# EAGLE design EasyCAN_diy (EAGLE 6.5.0)
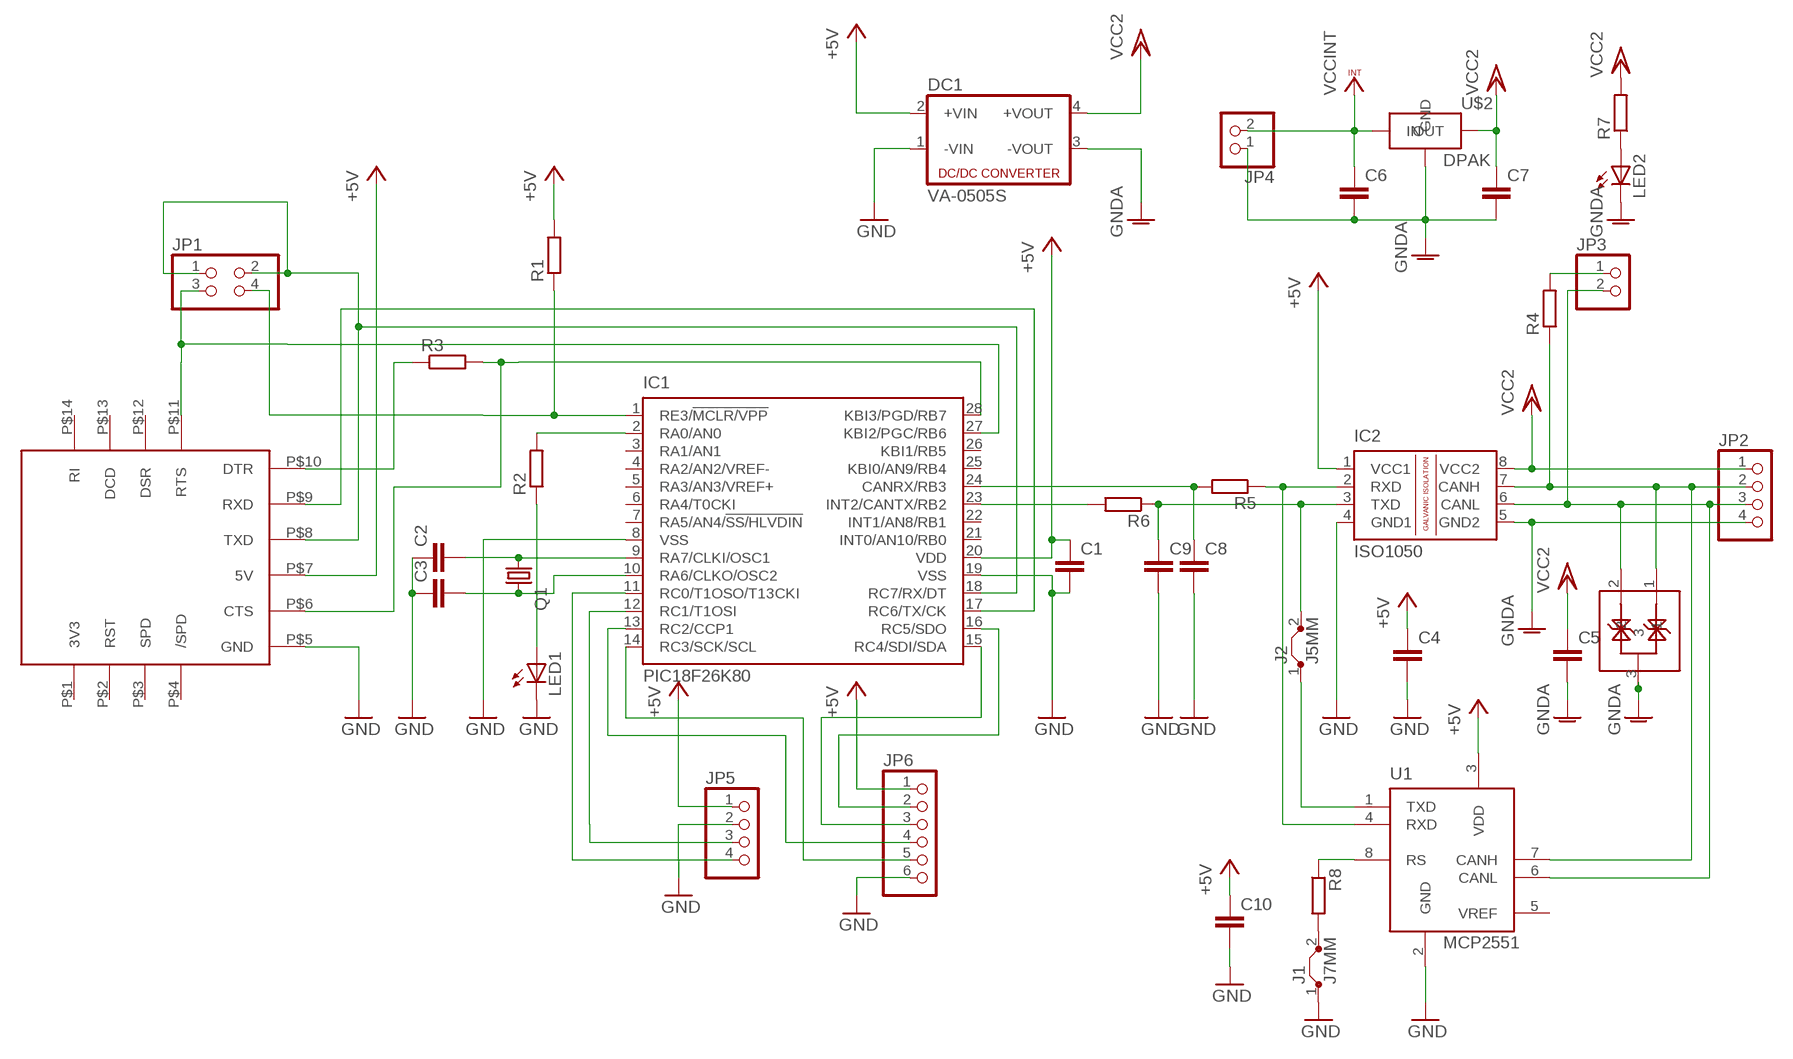
[diagram p0: schematic, sheet 1]

## Parts
C1  C-EUC1206  [C1206]
C2  C-EUC1206  [C1206]
C3  C-EUC1206  [C1206]
C4  C-EUC1206  [C1206]
C5  C-EUC1206  [C1206]
C6  C-EUC1206  [C1206]
C7  C-EUC1206  [C1206]
C8  C-EUC1206  [C1206]
C9  C-EUC1206  [C1206]
C10  C-EUC1206  [C1206]
D1  NUP2105L  [TO236]
DC1  VA-0505S  [4SIL]
IC1  PIC18F26K80  PIC18F26K80-E/SO  [SO28W]
IC2  ISO1050  ISO1050DUB  [DUB-R-PDSO-G8]
J1  J7MM  [07]
J2  J5MM  [05]
JP1  PINHD-2X2  [2X02]
JP2  PINHD-1X4  [1X04]
JP3  PINHD-1X2  [1X02]
JP4  PINHD-1X2  [1X02]
JP5  PINHD-1X4  [1X04]
JP6  PINHD-1X6  [1X06]
LED1  LEDSML1206  [SML1206]
LED2  LEDSML1206  [SML1206]
Q1  CRYSTALHC49UP  [HC49UP]
R1  R-EU_R1206  [R1206]
R2  R-EU_R1206  [R1206]
R3  R-EU_R1206  [R1206]
R4  R-EU_0204/7  [0204/7]
R5  R-EU_R1206  [R1206]
R6  R-EU_R1206  [R1206]
R7  R-EU_R1206  [R1206]
R8  R-EU_R1206  [R1206]
U1  MCP2551  MCP2551SO  [SO-08]
U$1  BTE13-007  [BTE13-007]
U$2  7805-DPAK  [7805-DPAK]

## Nets
+5V: C1.1 C4.1 C10.1 DC1.2(+VIN) IC1.20(VDD) IC2.1(VCC1) JP5.1 JP6.1 R1.2 U1.3(VDD) U$1.P$7(5V)
GND: C1.2 C2.1 C3.1 C4.2 C8.2 C9.2 C10.2 DC1.1(-VIN) IC1.8(VSS) IC1.19(VSS) IC2.4(GND1) J1.1 JP5.2 JP6.6 LED1.C U1.2(GND) U$1.P$5(GND)
GNDA: C5.2 C6.2 C7.2 D1.3 DC1.3(-VOUT) IC2.5(GND2) JP2.4 JP4.1 LED2.C U$2.GND
N$1: IC1.18(RC7/RX/DT) JP1.1 JP1.2 U$1.P$8(TXD)
N$2: IC1.17(RC6/TX/CK) U$1.P$9(RXD)
N$3: C2.2 IC1.9(RA7/CLKI/OSC1) Q1.2
N$4: C3.2 IC1.10(RA6/CLKO/OSC2) Q1.1
N$5: IC1.2(RA0/AN0) R2.2
N$6: IC1.1(RE3/!MCLR/VPP) JP1.4 R1.1
N$7: IC1.27(KBI2/PGC/RB6) JP1.3 U$1.P$11(RTS)
N$8: IC2.2(RXD) R5.1 U1.4(RXD)
N$9: IC1.28(KBI3/PGD/RB7) R3.2 U$1.P$6(CTS)
N$10: R3.1 U$1.P$10(DTR)
N$11: C8.1 IC1.24(CANRX/RB3) R5.2
N$12: J1.2 R8.2
N$13: LED2.A R7.1
N$14: R8.1 U1.8(RS)
N$15: C9.1 IC2.3(TXD) J2.2 R6.1
N$16: JP3.1 R4.2
N$17: LED1.A R2.1
N$18: IC1.11(RC0/T1OSO/T13CKI) JP5.4
N$19: IC1.12(RC1/T1OSI) JP5.3
N$20: IC1.13(RC2/CCP1) JP6.4
N$21: IC1.14(RC3/SCK/SCL) JP6.5
N$22: IC1.15(RC4/SDI/SDA) JP6.3
N$23: IC1.16(RC5/SDO) JP6.2
N$24: D1.2 IC2.6(CANL) JP2.3 JP3.2 U1.6(CANL)
N$25: D1.1 IC2.7(CANH) JP2.2 R4.1 U1.7(CANH)
N$26: IC1.23(INT2/CANTX/RB2) R6.2
N$27: J2.1 U1.1(TXD)
VCC/2: C5.1 C7.1 DC1.4(+VOUT) IC2.8(VCC2) JP2.1 R7.2 U$2.OUT ; supply symbol labelled VCC2
VCCINT: C6.1 JP4.2 U$2.IN
Unconnected: IC1.3(RA1/AN1) IC1.4(RA2/AN2/VREF-) IC1.5(RA3/AN3/VREF+) IC1.6(RA4/T0CKI) IC1.7(RA5/AN4/!SS/HLVDIN) IC1.21(INT0/AN10/RB0) IC1.22(INT1/AN8/RB1) IC1.25(KBI0/AN9/RB4) IC1.26(KBI1/RB5) U1.5(VREF) U$1.P$2(RST) U$1.P$3(SPD) U$1.P$4(/SPD) U$1.P$12(DSR) U$1.P$13(DCD) U$1.P$14(RI)

## Power pins joined to a net without a drawn wire
3V3: U$1.P$1(3V3)

## Library data of the parts
C1-C10 = resistor:C-EU: CAPACITOR, European symbol
D1 = CANBUS Protector:NUP2105L: DUAL BIDIRECTIONAL VOLTAGE SUPPRESSOR 350 W PEAK POWER
DC1 = dc-dc-converter:VA-*?: DC DC Converter Single Output, 1 Watt Motien Technology Co.,Ltd. Source: va-serie.pdf
IC1 = PIC18F26K80:PIC18F26K80: 28-Pin Enhanced Flash Microcontrollers with ECAN(TM) Technology 10-Bit A/D and nanoWatt Technology Source: http://www.microchip.com .. 39637a.pdf
IC2 = texas:ISO1050: ISOLATED CAN TRANSCEIVER Source: http://focus.ti.com/lit/ds/symlink/iso1050.pdf; MPN: ISO1050DUBR; OC_FARNELL: 1755712; OC_NEWARK: 14R9899
J1 J2 = jumper:J: Bridge
JP1 = pinhead:PINHD-2X2: PIN HEADER
JP2 JP5 = pinhead:PINHD-1X4: PIN HEADER
JP3 JP4 = pinhead:PINHD-1X2: PIN HEADER
JP6 = pinhead:PINHD-1X6: PIN HEADER
LED1 LED2 = led:LED: LED OSRAM: - CHIPLED LG R971, LG N971, LY N971, LG Q971, LY Q971, LO R971, LY R971 LH N974, LH R974 LS Q976, LO Q976, LY Q976 LO Q996 - Hyper CHIPLED LW Q18S LB Q993, LB Q99A, LB R99A - SideLED LS A670, LO A670, LY A670, LG A670, LP A670 LB A673, LV A673, LT A673, LW A673 LH A674 LY A675 LS A676, LA A676, LO A676, LY A676, LW A676 LS A679, LY A679, LG A679 - Hyper Micro SIDELED® LS Y876, LA Y876, LO Y876, LY Y876 LT Y87S - SmartLED LW L88C, LW L88S LB L89C, LB L89S, LG L890 LS L89K, LO L89K, LY L89K LS L896, LA L896, LO L896, LY L896 - TOPLED LS T670, LO T670, LY T670, LG T670, LP T670 LSG T670, LSP T670, LSY T670, LOP T670, LYG T670 LG T671, LOG T671, LSG T671 LB T673, LV T673, LT T673, LW T673 LH T674 LS T676, LA T676, LO T676, LY T676, LB T676, LH T676, LSB T676, LW T676 LB T67C, LV T67C, LT T67C, LS T67K, LO T67K, LY T67K, LW E67C LS E67B, LA E67B, LO E67B, LY E67B, LB E67C, LV E67C, LT E67C LW T67C LS T679, LY T679, LG T679 LS T770, LO T770, LY T770, LG T770, LP T770 LB T773, LV T773, LT T773, LW T773 LH T774 LS E675, LA E675, LY E675, LS T675 LS T776, LA T776, LO T776, LY T776, LB T776 LHGB T686 LT T68C, LB T68C - Hyper Mini TOPLED® LB M676 - Mini TOPLED Santana® LG M470 LS M47K, LO M47K, LY M47K Source: http://www.osram.convergy.de LUXEON: - LUMILED® LXK2-PW12-R00, LXK2-PW12-S00, LXK2-PW14-U00, LXK2-PW14-V00 LXK2-PM12-R00, LXK2-PM12-S00, LXK2-PM14-U00 LXK2-PE12-Q00, LXK2-PE12-R00, LXK2-PE12-S00, LXK2-PE14-T00, LXK2-PE14-U00 LXK2-PB12-K00, LXK2-PB12-L00, LXK2-PB12-M00, LXK2-PB14-N00, LXK2-PB14-P00, LXK2-PB14-Q00 LXK2-PR12-L00, LXK2-PR12-M00, LXK2-PR14-Q00, LXK2-PR14-R00 LXK2-PD12-Q00, LXK2-PD12-R00, LXK2-PD12-S00 LXK2-PH12-R00, LXK2-PH12-S00 LXK2-PL12-P00, LXK2-PL12-Q00, LXK2-PL12-R00 Source: www.luxeon.com KINGBRIGHT: KA-3528ASYC Source: www.kingbright.com
Q1 = crystal:CRYSTAL: CRYSTAL; OC_FARNELL: unknown; OC_NEWARK: unknown
R1-R8 = resistor:R-EU_: RESISTOR, European symbol
U1 = microchip_can:MCP2551: High Speed CAN tranceiver
U$1 = BTE13-007:BTE13-007: USB RS232 TTL Converter BTE13-007
U$2 = vreg-7805-dpak:7805-DPAK

## Board
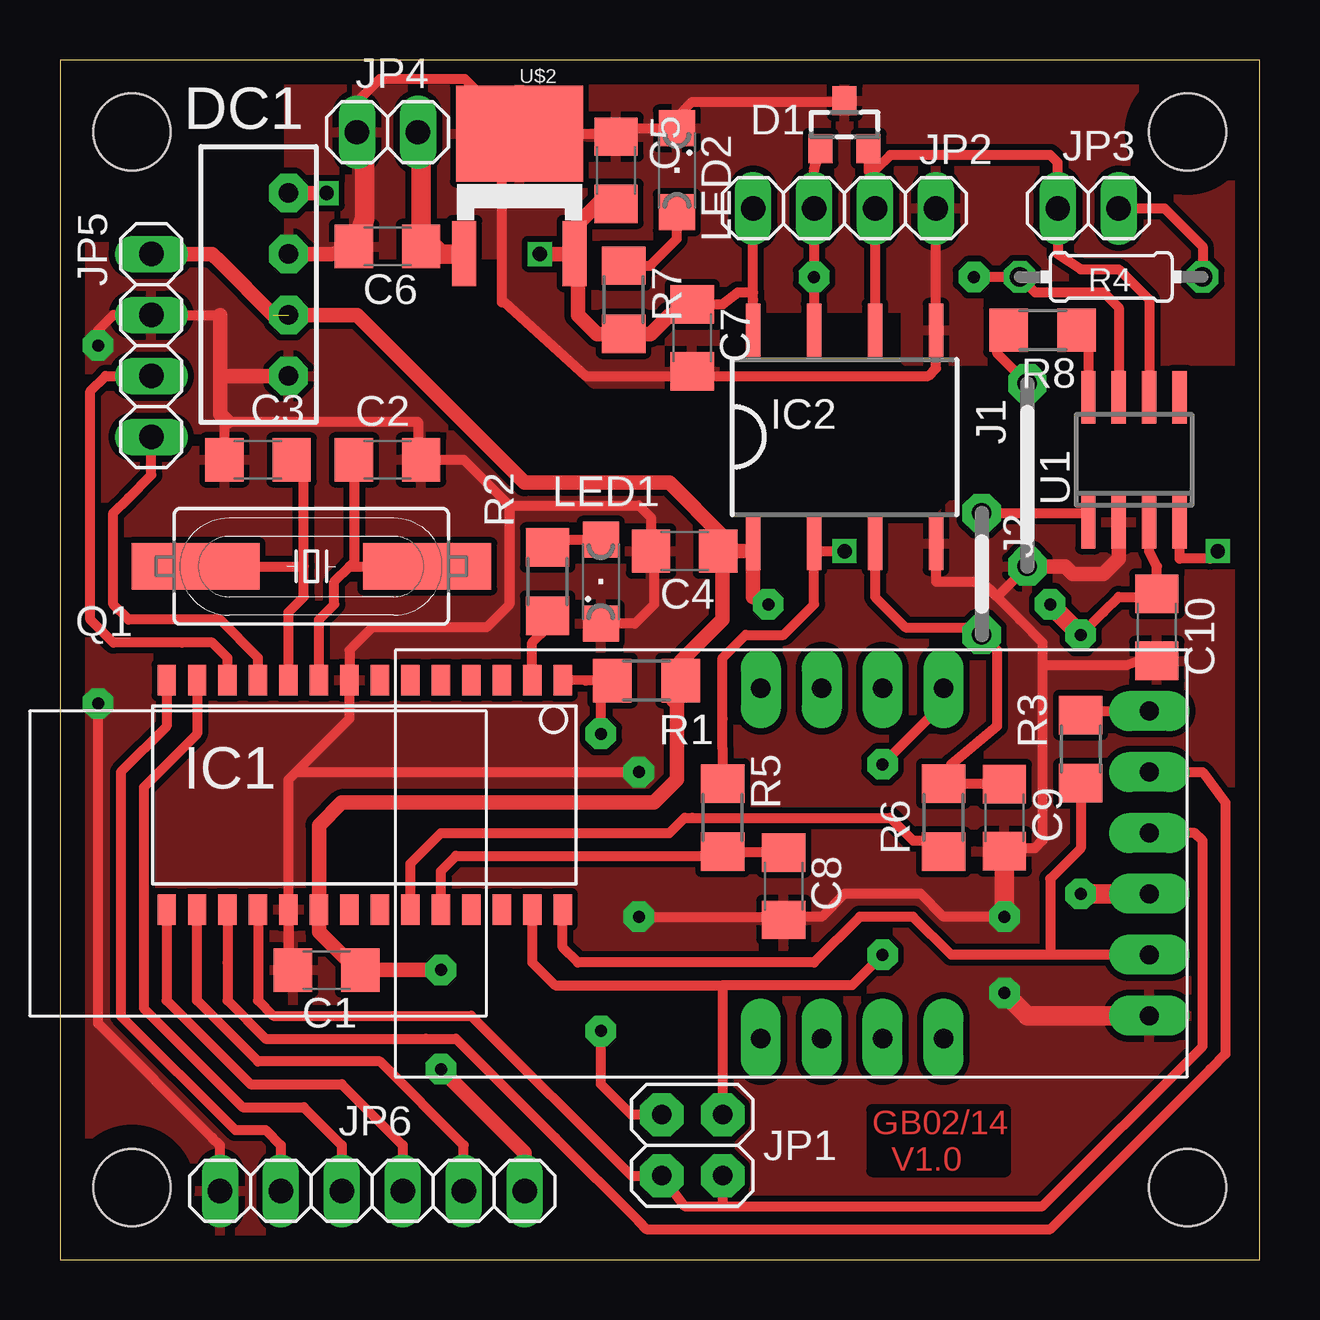
[diagram p1: board, top side]
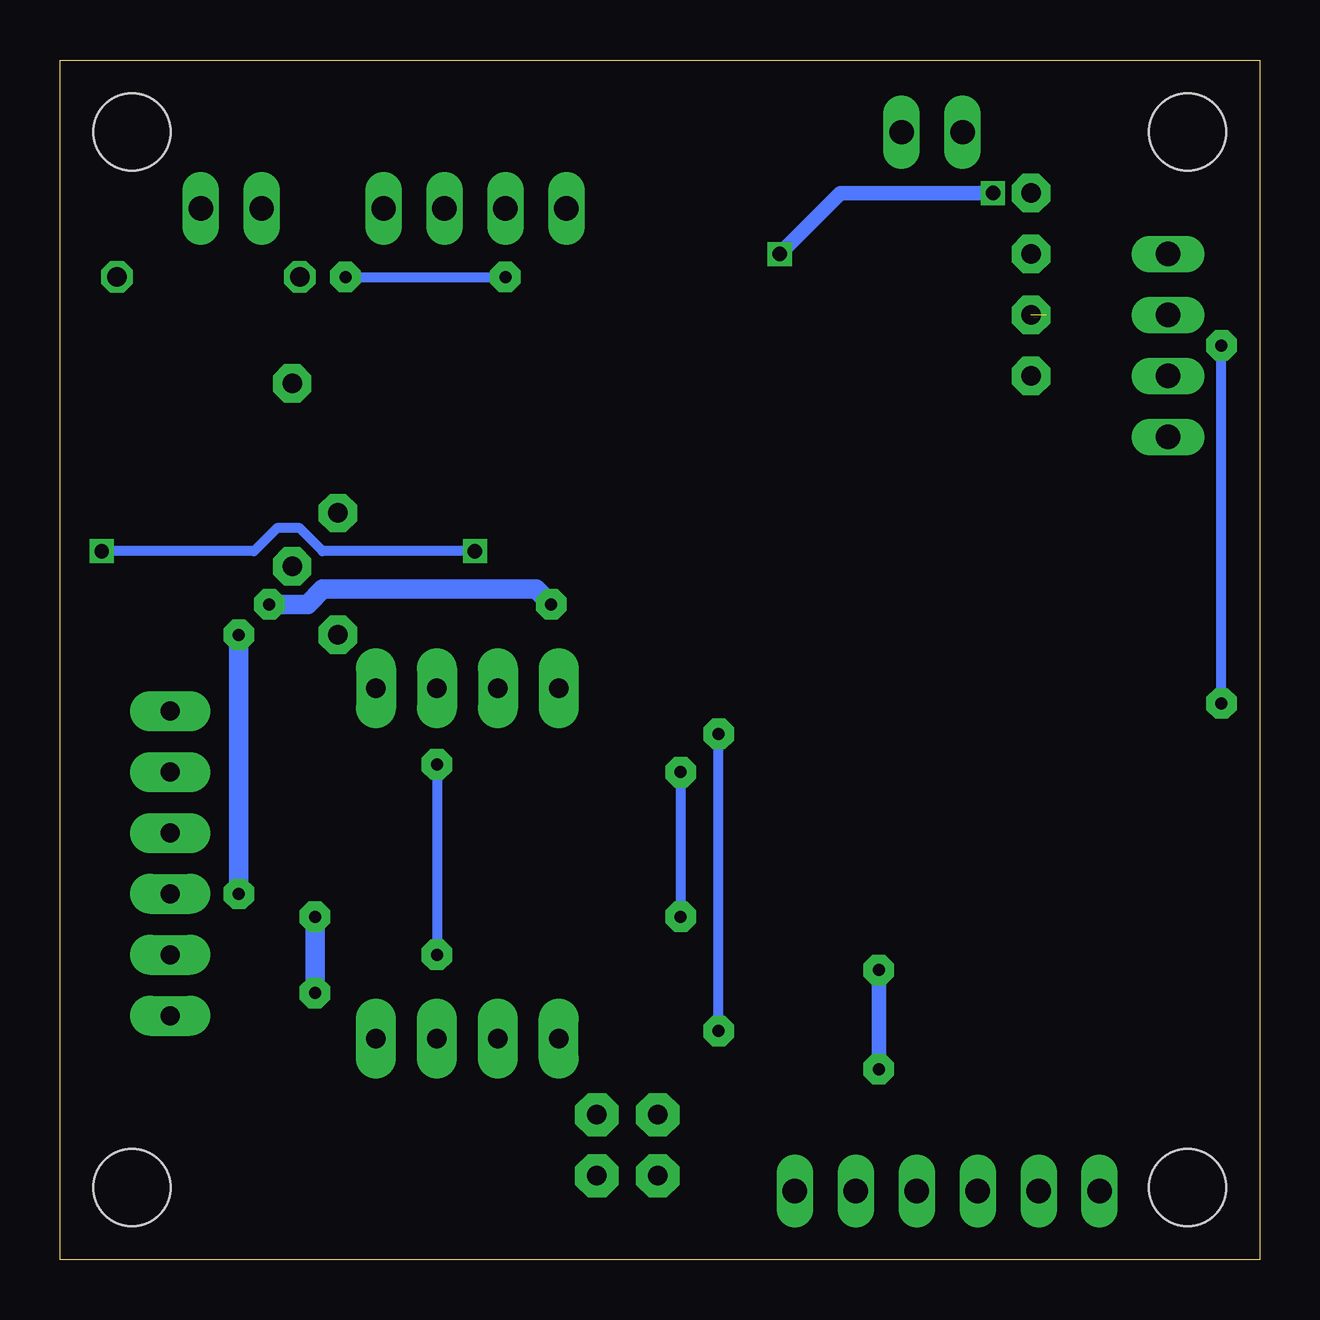
[diagram p2: board, bottom side, seen from below]

Size 50 x 50 mm. Coordinates in mm from the lower left corner, seen from the top.
Outline: 0,0 50,0 50,50 0,50 0,0
Copper layers (1*16): Top 0.035mm / dielectric 1.5mm / Bottom 0.035mm
Design rules "default": minimum track width 10mil, minimum drill 24mil, track to track 8mil, track to pad 8mil, pad to pad 8mil, via to via 8mil, smd to smd 8mil, copper to edge 40mil, drill to drill 8mil, minimum pad ring 10mil, minimum via ring 8mil, stop-mask expansion 4mil, vias tented up to drill 0mil, thermal gap 10mil
Holes 3.2 mm at 3,3 47,3 3,47 47,47

### Footprints (pad centres in the part's own frame; a part is rotated, then mirrored left to right if it is on the bottom)
C1206 = smd 1.6 x 1.8: 1 -1.4,0; 2 1.4,0
TO236 = smd 1 x 1.2: 1 -1,-1; 2 1,-1; 3 0,1
4SIL = drill 0.813 pad 1.6 octagon: 1 -3.81,0; 2 -1.27,0; 3 1.27,0; 4 3.81,0
SO28W = smd 0.762 x 1.27: 1 -7.62,-4.78; 2 -6.35,-4.78; 3 -5.08,-4.78; 4 -3.81,-4.78; 5 -2.54,-4.78; 6 -1.27,-4.78; 7 0,-4.78; 8 1.27,-4.78; 9 2.54,-4.78; 10 3.81,-4.78; 11 5.08,-4.78; 12 6.35,-4.78; 13 7.62,-4.78; 14 8.89,-4.78; 15 8.89,4.78; 16 7.62,4.78; 17 6.35,4.78; 18 5.08,4.78; 19 3.81,4.78; 20 2.54,4.78; 21 1.27,4.78; 22 0,4.78; 23 -1.27,4.78; 24 -2.54,4.78; 25 -3.81,4.78; 26 -5.08,4.78; 27 -6.35,4.78; 28 -7.62,4.78
DUB-R-PDSO-G8 = smd 0.6 x 2.2: 1 -3.81,-4.445; 2 -1.27,-4.445; 3 1.27,-4.445; 4 3.81,-4.445; 5 3.81,4.445; 6 1.27,4.445; 7 -1.27,4.445; 8 -3.81,4.445
07 = drill 0.813 pad 1.6 octagon: 1 -3.81,0; 2 3.81,0
05 = drill 0.813 pad 1.6 octagon: 1 -2.54,0; 2 2.54,0
2X02 = drill 0.813 pad 1.8 octagon: 1 -1.27,-1.27; 2 -1.27,1.27; 3 1.27,-1.27; 4 1.27,1.27
1X04 = drill 1.016 long: 1 -3.81,0; 2 -1.27,0; 3 1.27,0; 4 3.81,0
1X02 = drill 1.016 long: 1 -1.27,0; 2 1.27,0
1X06 = drill 1.016 long: 1 -6.35,0; 2 -3.81,0; 3 -1.27,0; 4 1.27,0; 5 3.81,0; 6 6.35,0
SML1206 = smd 1.5 x 1.5: A 1.75,0; C -1.75,0
HC49UP = smd 5.334 x 1.93: 1 -4.826,0; 2 4.826,0
R1206 = smd 1.6 x 1.803: 1 -1.422,0; 2 1.422,0
0204/7 = drill 0.813 octagon: 1 -3.81,0; 2 3.81,0
SO-08 = smd 0.6 x 2.2: 1 -1.905,-2.6; 2 -0.635,-2.6; 3 0.635,-2.6; 4 1.905,-2.6; 5 1.905,2.6; 6 0.635,2.6; 7 -0.635,2.6; 8 -1.905,2.6
BTE13-007 = drill 0.8 pad 1.676 long: P$1 0,0; P$2 2.54,0; P$3 5.08,0; P$4 7.62,0; P$5 16.192,0.953; P$6 16.192,3.493; P$7 16.192,6.032; P$8 16.192,8.572; P$9 16.192,11.113; P$10 16.192,13.652; P$11 7.62,14.605; P$12 5.08,14.605; P$13 2.54,14.605; P$14 0,14.605
7805-DPAK = smd 5.3 x 4: GND 0.1,2.8 | smd 1 x 2.7: IN -2.2,-2.2; OUT 2.4,-2.2

### Placement (x,y rotation side)
C1  11.11,12.06 180 top
C2  13.65,33.34 180 top
C3  8.26,33.34 0 top
C4  26.04,29.53 180 top
C5  23.18,45.4 90 top
C6  13.65,42.23 180 top
C7  26.35,38.42 270 top
C8  30.16,15.56 270 top
C9  39.37,18.41 270 top
C10  45.72,26.35 270 top
D1  32.7,47.31 0 top
DC1  9.53,40.64 90 top
IC1  13.34,19.37 180 top
IC2  32.7,34.29 0 top
J1  40.32,32.7 90 top
J2  38.42,28.57 270 top
JP1  26.35,4.76 90 top
JP2  32.7,43.81 0 top
JP3  42.86,43.81 180 top
JP4  13.65,46.99 0 top
JP5  3.81,38.1 270 top
JP6  13.02,2.86 180 top
LED1  22.54,28.26 90 top
LED2  25.72,45.4 270 top
Q1  10.48,28.89 0 top
R1  24.45,24.13 0 top
R2  20.32,28.26 270 top
R3  42.55,21.27 270 top
R4  43.81,40.96 0 top
R5  27.62,18.41 270 top
R6  36.83,18.41 270 top
R7  23.5,40.01 270 top
R8  40.96,38.73 180 top
U1  44.77,33.34 0 top
U$1  29.21,9.21 0 top
U$2  19.05,44.13 0 top

### Tracks (layer width: path | path; a pad name or v marks a point on that pad's centre or on a via)
+5V  (via drill 0.5 pad 1.27)  (1 unrouted)
  Top 0.406: 27.62,30.16 27.62,29.71 C4.1 27.62,29.34 | 28.89,29.53 IC2.1 | R1.2 25.87,24.92 | 28.89,27.62 v29.53,27.3 | v41.27,27.3 41.59,26.99 | C1.1 12.38,12.06 | v42.55,26.04 43.5,26.99 44.13,27.62 45.59,27.62 C10.1 45.72,28.89 45.4,29.53 U1.3
  Top 0.61: 27.62,30.16 25.4,32.38 19.37,32.38 15.56,36.2 12.38,39.37 8.89,39.37 6.67,41.59 6.35,41.91 JP5.1 | C4.1 28.89,29.53 | 25.87,24.92 27.62,26.67 27.62,29.34 | IC2.1 28.89,27.62 | C1.1 v15.88,12.06 | v15.88,7.94 19.37,4.45 JP6.1 | R1.2 25.55,23.33 25.72,23.18 25.72,20 24.77,19.05 11.75,19.05 10.79,18.1 IC1.20 10.79,13.65 12.38,12.06
  Top 0.813: 41.59,26.99 v42.55,26.04 | v42.55,15.24 U$1.P$7
  Bottom 0.61: v15.88,12.06 v15.88,7.94
  Bottom 0.813: v29.53,27.3 30.16,27.94 39.05,27.94 39.69,27.3 v41.27,27.3 | v42.55,26.04 v42.55,15.24
GND  (via drill 0.5 pad 1.27)
  Top 0.406: IC1.19 9.53,12.06 | 9.53,12.06 C1.2 | 9.53,12.06 9.53,20 9.84,20.32 | 9.84,20.32 12.06,22.54 IC1.8 12.06,25.4 13.02,26.35 17.78,26.35 18.73,27.3 | JP5.2 6.67,39.37 | 6.67,33.52 C3.1 6.86,34.92 6.99,34.92 14.92,34.92 14.92,33.34 C2.1 16.83,33.34 18.73,31.43 | 18.73,31.43 18.73,27.3 | 18.73,27.3 18.73,31.43 | 18.73,31.43 24.13,31.43 24.64,30.93 C4.2 24.77,29.4 | 24.77,29.4 24.77,27.3 23.97,26.51 LED1.C | JP5.2 2.86,39.37 | JP6.6 6.67,4.76 6.35,5.08 1.59,9.84 v1.59,23.18 | v1.59,38.1 1.59,38.73 2.22,39.37 JP5.2 | v39.37,14.29 36.83,14.29 35.88,15.24 32.7,15.24 31.75,14.29 30.48,14.29 | 30.48,14.29 30.29,14.29 C8.2 30.03,14.29 v24.13,14.29 | IC2.4 36.51,28.26 38.42,28.26 | 38.42,28.26 38.73,27.94 | 38.73,27.94 40.01,26.67 40.96,25.72 40.96,24.77 | 40.96,24.77 40.96,23.18 40.96,17.46 40.64,17.14 39.5,17.14 C9.2 | J1.1 39.05,27.62 38.73,27.94 | 38.73,27.94 38.42,28.26 | 24.77,29.4 24.77,29.53 | 30.16,13.97 30.48,13.97 30.48,14.29 | 9.84,20.32 v24.13,20.32 | C10.2 44.95,24.95 44.45,24.77 40.96,24.77
  Top 0.61: 6.67,39.37 6.67,36.83 | 6.67,36.83 6.67,35.24 6.99,34.92 | DC1.1 6.67,36.83 | U1.2 44.13,29.21 43.5,28.57 42.23,28.57 41.91,28.89 J1.1
  Top 0.813: U$1.P$5 40.32,10.16 v39.37,11.11 | v39.37,14.29 C9.2
  Bottom 0.406: v1.59,23.18 v1.59,38.1 | v24.13,20.32 v24.13,14.29
  Bottom 0.813: v39.37,11.11 v39.37,14.29
  pour Top (isolate 0.254): 0,0 0,42.23 6.35,42.23 9.53,39.05 12.7,39.05 19.37,32.38 25.4,32.38 27.3,30.48 36.2,30.48 38.42,32.7 41.27,32.7 42.23,31.75 49.85,31.75 49.85,0
GNDA
  Top 0.406: JP2.4 IC2.5 36.51,37.15 36.2,36.83 26.35,36.83 21.91,36.83 18.52,39.91 18.41,39.91 18.41,46.04 U$2.GND | D1.3 32.43,48.26 26.35,48.26 25.72,47.62 LED2.C 23.18,47.15 | U$2.GND 23.18,46.93 C5.2 | JP4.1 12.38,48.26 13.34,49.21 16.87,49.21 U$2.GND
  Top 0.61: 23.18,47.15 C5.2 | 19.15,47.15 U$2.GND | C7.2 26.35,36.83 | DC1.3 11.3,41.91 C6.2
  Top 0.813: JP4.1 12.7,46.04 12.7,43.37 C6.2
  pour Top (isolate 0.254): 9.53,49.85 9.53,41.91 18.41,41.91 18.41,40.32 22.23,36.51 27.3,36.51 27.3,39.69 35.24,39.69 35.24,37.47 50.16,37.47 50.16,49.85
N$1
  Top 0.406: IC1.18 8.26,10.79 8.89,10.16 17.14,10.16 23.81,3.49 JP1.2 26.04,2.22 27.62,2.22 | 27.62,2.22 40.96,2.22 47.62,8.89 47.62,17.46 47.31,17.78 U$1.P$8 | JP1.1 27.62,3.17 27.62,2.22
N$2
  Top 0.406: IC1.17 6.99,12.38 6.99,10.79 8.57,9.21 15.24,9.21 16.51,9.21 20.64,5.08 24.13,1.59 24.45,1.27 41.27,1.27 47.94,7.94 48.58,8.57 48.58,19.05 47.62,20.32 U$1.P$9
N$3
  Top 0.406: IC1.9 10.79,26.67 11.43,27.3 11.43,28.26 12.06,28.89 | 12.06,28.89 Q1.2 | C2.2 12.25,29.08 12.06,28.89
N$4
  Top 0.406: IC1.10 9.53,26.99 10.16,27.62 10.16,28.89 | 10.16,28.89 10.16,32.83 C3.2 | Q1.1 10.16,28.89
N$5
  Top 0.406: IC1.2 19.68,25.72 20.32,26.35 R2.2
N$6  (via drill 0.5 pad 1.27)
  Top 0.406: IC1.1 21.93,24.13 R1.1 22.54,23.66 v22.54,21.91 | JP1.4 23.81,6.03 22.54,7.3 v22.54,9.53
  Bottom 0.406: v22.54,9.53 v22.54,21.91
N$7  (via drill 0.5 pad 1.27)
  Top 0.406: U$1.P$11 36.83,23.18 v34.29,20.64 | v34.29,12.7 33.02,11.43 27.62,11.43 | 27.62,11.43 JP1.3 | IC1.27 19.68,12.38 20.64,11.43 27.62,11.43
  Bottom 0.406: v34.29,20.64 v34.29,12.7
N$8  (via drill 0.6)
  Top 0.406: R5.1 27.62,21.27 27.62,22.54 27.62,25.08 28.57,26.04 30.16,26.04 31.43,27.3 IC2.2 31.43,29.53 v32.7,29.53 | v48.26,29.53 47.94,29.21 46.67,29.21 U1.4
  Bottom 0.406: v32.7,29.53 39.05,29.53 40.01,30.48 40.96,30.48 41.91,29.53 v48.26,29.53
N$9
  Top 0.406: U$1.P$6 43.5,12.7 42.23,12.7 41.59,12.7 41.27,12.7 | 41.27,12.7 37.15,12.7 35.56,14.29 33.34,14.29 31.43,12.38 21.59,12.38 20.95,13.02 IC1.28 | R3.2 42.55,17.14 41.27,15.88 41.27,12.7
N$10
  Top 0.406: R3.1 42.7,22.7 43.5,22.86 U$1.P$10
N$11
  Top 0.406: IC1.24 15.88,16.19 16.51,16.83 27.46,16.83 R5.2 30.45,16.99 C8.1
N$12
  Top 0.406: J1.2 39.05,37.78 39.22,38.73 R8.2
N$13
  Top 0.406: R7.1 24.6,41.43 25.72,42.55 LED2.A
N$14
  Top 0.406: R8.1 42.55,38.42 42.86,38.1 U1.8
N$15
  Top 0.406: IC2.3 33.97,27.62 35.24,26.35 38.1,26.35 J2.2 | J2.2 38.73,25.72 | 38.73,25.72 39.05,25.4 39.05,22.23 37.15,20.64 R6.1 39.35,19.84 C9.1 | J2.2 38.73,25.72
N$16
  Top 0.406: JP3.1 46.04,43.81 47.62,42.23 R4.2
N$17
  Top 0.406: R2.1 20.32,29.84 20.32,30.01 LED1.A
N$18
  Top 0.406: IC1.11 8.26,25.08 6.67,26.67 2.86,26.67 2.22,27.3 2.22,31.11 2.86,31.75 3.81,32.7 JP5.4
N$19
  Top 0.406: IC1.12 6.99,25.08 6.35,25.72 5.08,25.72 2.22,25.72 1.27,26.67 1.27,36.2 1.91,36.83 JP5.3
N$20
  Top 0.406: IC1.13 5.71,21.91 3.49,19.68 3.49,10.48 7.62,6.35 10.16,6.35 11.75,4.76 JP6.4
N$21
  Top 0.406: IC1.14 4.45,22.23 2.54,20.32 2.54,10.16 7.3,5.4 8.57,5.4 9.21,4.76 JP6.5
N$22
  Top 0.406: IC1.15 4.45,10.79 7.94,7.3 11.75,7.3 14.29,4.76 JP6.3
N$23
  Top 0.406: JP6.2 16.83,4.76 13.34,8.26 8.26,8.26 5.71,10.79 5.71,12.06 5.71,13.65 IC1.16
N$24
  Top 0.406: D1.2 33.7,45.35 33.97,45.09 JP2.3 | JP2.3 IC2.6 | JP2.3 33.97,45.4 | 33.97,45.4 33.97,46.04 | 33.97,45.4 34.61,46.04 41.27,46.04 41.59,45.72 JP3.2 41.59,41.91 42.55,41.27 44.13,41.27 45.4,40.01 U1.6
N$25  (via drill 0.5 pad 1.27)
  Top 0.406: D1.1 31.43,45.4 JP2.2 v31.43,40.96 IC2.7 | v38.1,40.96 R4.1 40.64,40.32 41.59,40.32 43.5,40.32 44.13,39.69 U1.7
  Bottom 0.406: v38.1,40.96 v31.43,40.96
N$26
  Top 0.406: IC1.23 14.61,16.51 15.88,17.78 25.4,17.78 26.04,18.41 26.35,18.41 34.61,18.41 35.56,17.46 36.99,17.46 R6.2
N$27
  Top 0.406: J2.1 42.86,31.11 U1.1
VCC/2  (via drill 0.6)
  Top 0.406: IC2.8 28.89,40.01 28.89,40.32 | 28.89,40.32 JP2.1 | 26.16,39.82 27.62,39.82 28.26,40.32 28.89,40.32
  Top 0.61: U$2.OUT 21.59,41.79 21.59,39.37 22.38,38.58 R7.2 24.61,38.58 25.4,39.37 26.22,39.37 C7.1 26.16,39.82 | U$2.OUT 21.45,43.04 22.54,44.13 23.05,44.13 C5.1 | DC1.4 v11.11,44.45 | v20,41.91 21.43,41.91 U$2.OUT
  Bottom 0.61: v11.11,44.45 17.46,44.45 v20,41.91
VCCINT
  Top 0.813: U$2.IN 16.83,41.91 15.88,41.91 14.92,42.86 C6.1 15.05,45.91 14.92,46.35 JP4.2

### Text on the board
Top: GB02/14 / V1.0